# EAGLE schematic ESP8285_SMD_0603 (EAGLE 9.6.2)
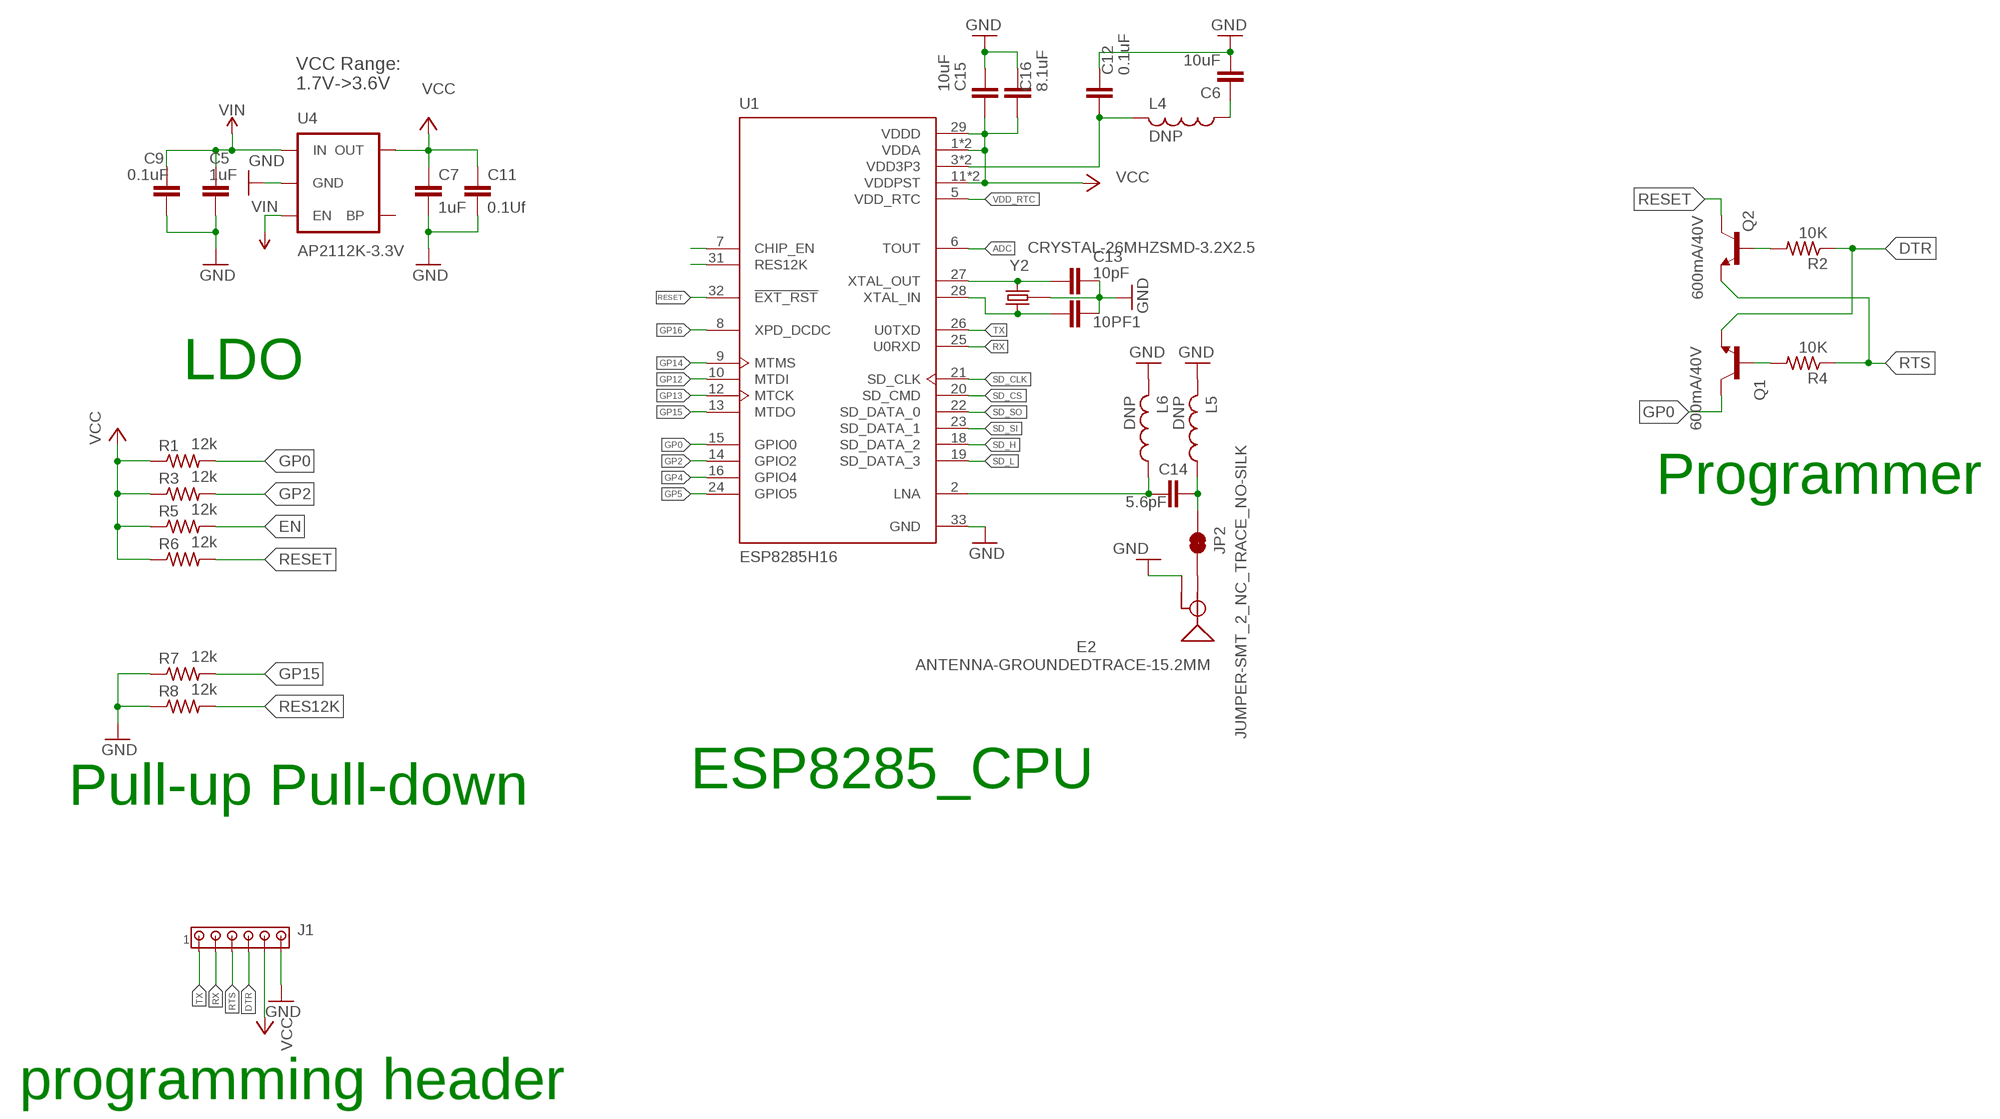
[diagram p0: schematic, sheet 1]

## Parts
10PF1  C-EUC0603  [C0603]
C5  1uF  C-EUC0603  [C0603]
C6  10uF  C-EUC0603  [C0603]
C7  1uF  C-EUC0603  [C0603]
C9  0.1uF  C-EUC0603  [C0603]
C11  0.1Uf  C-EUC0603  [C0603]
C12  0.1uF  C-EUC0603  [C0603]
C13  10pF  C-EUC0603  [C0603]
C14  5.6pF  C-EUC0603  [C0603]
C15  10uF  C-EUC0603  [C0603]
C16  8.1uF  C-EUC0603  [C0603]
E2  ANTENNA-GROUNDEDTRACE-15.2MM  [TRACE_ANTENNA_2.4GHZ_15.2MM]
J1  MTA06-100  [10X06MTA]
JP2  JUMPER-SMT_2_NC_TRACE_NO-SILK  [SMT-JUMPER_2_NC_TRACE_NO-SILK]
L4  DNP  L-USL0603  [L0603]
L5  DNP  L-USL0603  [L0603]
L6  DNP  L-USL0603  [L0603]
Q1  600mA/40V  TRANS_NPN-MMBT2222AL  [SOT23-3]
Q2  600mA/40V  TRANS_NPN-MMBT2222AL  [SOT23-3]
R1  12k  R-US_R0603  [R0603]
R2  10K  R-US_R0603  [R0603]
R3  12k  R-US_R0603  [R0603]
R4  10K  R-US_R0603  [R0603]
R5  12k  R-US_R0603  [R0603]
R6  12k  R-US_R0603  [R0603]
R7  12k  R-US_R0603  [R0603]
R8  12k  R-US_R0603  [R0603]
U1  ESP8285H16  [QFN50P500X500X90-33N]
U4  AP2112K-3.3V  V_REG_LDOSMD  [SOT23-5]
Y2  CRYSTAL-26MHZSMD-3.2X2.5  [CRYSTAL-SMD-3.2X2.5MM]

## Nets
ADC: U1.6(TOUT)
DTR: J1.4 Q1.2(E) R2.1
EN: R5.2
GND: 10PF1.1 C5.2 C6.2 C7.2 C9.2 C11.2 C12.2 C13.1 C15.1 C16.1 E2.GND J1.6 L5.2 L6.2 R7.1 R8.1 U1.33(GND) U4.2(GND) Y2.2 Y2.4
GP0: Q1.3(C) R1.2 U1.15(GPIO0)
GP2: R3.2 U1.14(GPIO2)
GP4: U1.16(GPIO4)
GP5: U1.24(GPIO5)
GP12: U1.10(MTDI)
GP13: U1.12(MTCK)
GP14: U1.9(MTMS)
GP15: R7.2 U1.13(MTDO)
GP16: U1.8(XPD_DCDC)
N$8: Q1.1(B) R4.2
N$9: Q2.1(B) R2.2
N$10: U1.7(CHIP_EN)
N$11: U1.31(RES12K)
N$12: C6.1 L4.1
N$13: C12.1 L4.2 U1.3(VDD3P3) U1.4(VDD3P3)
N$23: C13.2 U1.27(XTAL_OUT) Y2.3
N$24: C14.1 JP2.1 L5.1
N$25: E2.ANT(SIGNAL) JP2.2
N$26: C14.2 L6.1 U1.2(LNA)
N$29: 10PF1.2 U1.28(XTAL_IN) Y2.1
RES12K: R8.2
RESET: Q2.3(C) R6.2 U1.32(!EXT_RST)
RTS: J1.3 Q2.2(E) R4.1
RX: J1.2 U1.25(U0RXD)
SD_CLK: U1.21(SD_CLK)
SD_CS: U1.20(SD_CMD)
SD_H: U1.18(SD_DATA_2)
SD_L: U1.19(SD_DATA_3)
SD_SI: U1.23(SD_DATA_1)
SD_SO: U1.22(SD_DATA_0)
TX: J1.1 U1.26(U0TXD)
VCC: C7.1 C11.1 C15.2 C16.2 J1.5 R1.1 R3.1 R5.1 R6.1 U1.1(VDDA) U1.11(VDDPST) U1.17(VDDPST) U1.29(VDDD) U1.30(VDDA) U4.5(OUT)
VDD_RTC: U1.5(VDD_RTC)
VIN: C5.1 C9.1 U4.1(IN) U4.3(EN)
Unconnected: U4.4(BP)

## Notes on the sheet
- VCC Range:
  1.7V->3.6V
- LDO
- Programmer
- Pull-up Pull-down | ESP8285_CPU
- programming header

## Library data of the parts
10PF1 C5-C7 C9 C11-C16 = rcl:C-EU: CAPACITOR, European symbol; SPICEPREFIX: C
E2 = SparkFun-RF:ANTENNA-GROUNDED: Antenna w/ Ground Connection 2.4GHz antennae with signal and ground terminals. TRACE_ANTENNA_2.4GHZ_15.2MM - Meander Trace antenna 15.2 x 5.7mm footprint Based on layout from TI app note AN043 <http://www.ti.com/lit/an/swra117d/swra117d.pdf>. TRACE_ANTENNA_2.4GHZ_25.7MM - Inverted F trace antenna 25.7 x 7.5 mm footprint. Based on layout from TI design note DN0007 <http://www.ti.com/lit/an/swru120b/swru120b.pdf>.
J1 = con-amp:MTA06-100: AMP connector Connection corrected 2014-09-19
JP2 = SparkFun-Jumpers:JUMPER-SMT_2_NC_TRACE: Normally closed trace jumper This jumper has a trace between two pads so it's normally closed (NC). Use a razor knife to open the connection. For best results follow the IPC guidelines for cutting traces: Cutout at least 0.063 mm (0.005 in). Remove all loose material to clean up the cut area. Seal the cut with an approved epoxy. Reapply solder to reclose the connection.
L4-L6 = rcl-2:L-US: INDUCTOR, American symbol
Q1 Q2 = SparkFun-DiscreteSemi:TRANS_NPN: NPN transistor Current controlled devices typically used to amplify current or used as a switch. BC547 - COM-08928 <http://www.sparkfun.com/products/8928> (TO-92 45V 100mA) (1.Collector 2.Base 3.Emitter) 2N3904 - COM-00521 <http://www.sparkfun.com/products/521> (TO-92 40V 200mA) (1.Emitter 2.Base 3.Collector) P2N2222A - COM-12852 <http://www.sparkfun.com/products/12852> (TO-92 40V 600mA) (1.Collector 2.Base 3.Emitter); PROD_ID: TRANS-08049
R1 R3 R5-R8 = rcl-2:R-US_: RESISTOR, American symbol
R2 R4 = rcl:R-US_: RESISTOR, American symbol; SPICEPREFIX: R
U1 = ESP8285H16:ESP8285H16: IC RF TxRx + MCU WiFi 802.11b/g/n 2.4GHz 32-VFQFN Exposed Pad Check prices <https://pricing.snapeda.com/parts/ESP8285H16/Espressif%20Systems/view-part?ref=eda>; AVAILABILITY: Warning; DESCRIPTION: IC RF TxRx + MCU WiFi 802.11b/g/n 2.4GHz 32-VFQFN Exposed Pad; MF: Espressif Systems; MP: ESP8285H16; PACKAGE: VFQFN-32 Espressif Systems; PRICE: None; PURCHASE-URL: https://pricing.snapeda.com/search/part/ESP8285H16/?ref=eda
U4 = SparkFun-PowerIC:V_REG_LDO: Voltage Regulator LDO Standard 150mA LDO voltage regulator in SOT-23 layout. Micrel part MIC5205. BP (by-pass) pin is used to lower output noise with 470pF cap.; PROD_ID: VREG-12457
Y2 = SparkFun-Clocks:CRYSTAL-26MHZ: 26MHz Crystal w/ Ground Pin Digikey Example <http://www.digikey.com/product-detail/en/epson/TSX-3225%2026.0000MF09Z-AC3/SER3627CT-ND/1802878> Frequency: 26MHz Frequency Stability: ±9ppm Frequency Tolerance: ±10ppm Load Capacitance: 9pF SparkFun Products: SparkFun ESP32 Thing <https://www.sparkfun.com/products/13907> SparkFun ESP8266 Thing Dev Board <https://www.sparkfun.com/products/13711>; PROD_ID: XTAL-12454